# Altium schematic sheet k02-breakout.SchDoc
size Letter
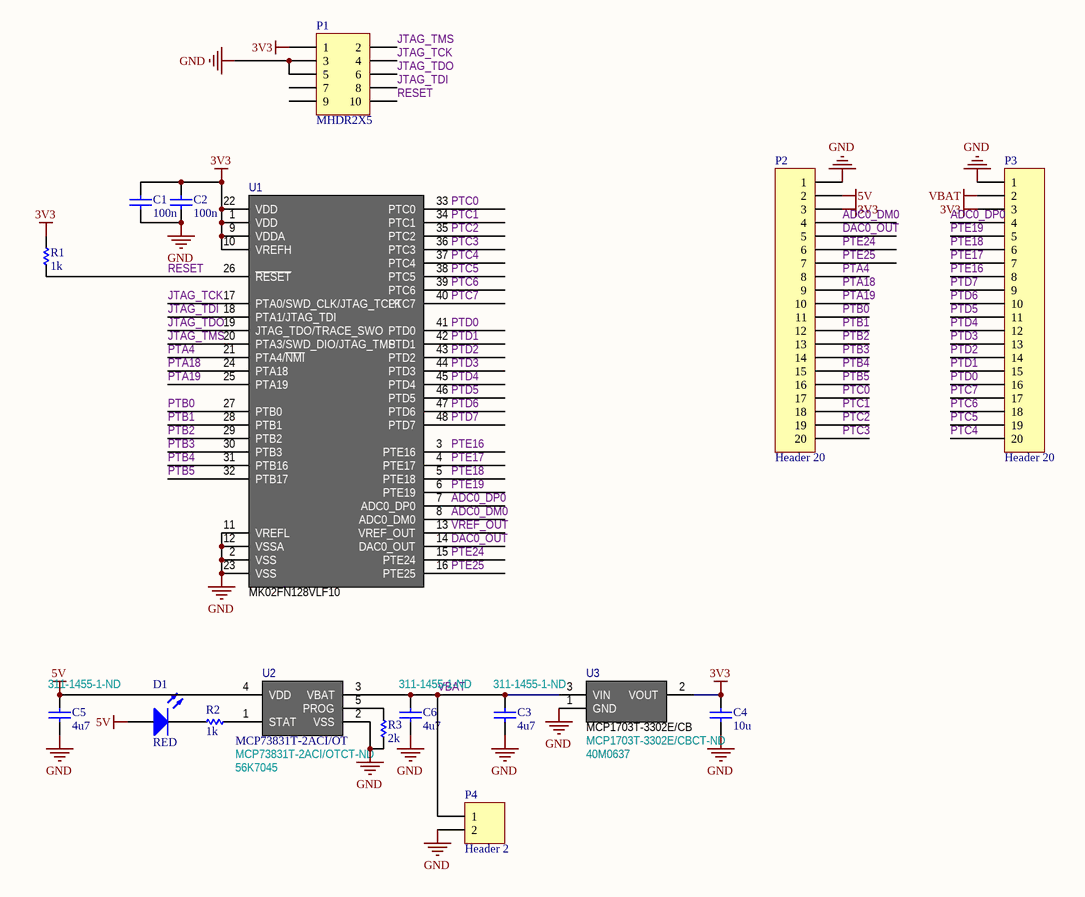
[diagram p0: k02-breakout.SchDoc]

## Parts
C1  100n  [CAPC1608N]
C2  100n  [CAPC1608N]
C3  4u7  Supplier Part Number 1: 311-1455-1-ND  [CAPC1608N]
C4  10u  [CAPC1608N]
C5  4u7  Supplier Part Number 1: 311-1455-1-ND  [CAPC1608N]
C6  4u7  Supplier Part Number 1: 311-1455-1-ND  [CAPC1608N]
D1  RED  [LTST-C190EKT]
P1  MHDR2X5  [MHDR2X5SMD]
P2  Header 20  [HDR1X20]
P3  Header 20  [HDR1X20]
P4  Header 2  [S2B-PH-SM4-TB]
R1  1k  [RESC1608N]
R2  1k  [RESC1608N]
R3  2k  [RESC1608N]
U1  MK02FN128VLF10  [TSQFP50P900X900-48N]
U2  MCP73831T-2ACI/OT  Supplier Part Number 1: MCP73831T-2ACI/OTCT-ND  Supplier Part Number 2: 56K7045  [SOT23-5AN]
U3  MCP1703T-3302E/CB  Supplier Part Number 1: MCP1703T-3302E/CBCT-ND  Supplier Part Number 2: 40M0637  [SOT23-3N]

## Nets
3V3: C1.2 C2.2 C4.2 P1.1 P2.3 P3.3 R1.2 U1.1(VDD) U1.9(VDDA) U1.10(VREFH) U1.22(VDD) U3.2(VOUT)
5V: C5.2 D1.1(A) P2.2 U2.4(VDD)
GND: C1.1 C2.1 C3.1 C4.1 C5.1 C6.1 P1.3 P1.5 P2.1 P3.1 P4.2 R3.1 U1.2(VSS) U1.11(VREFL) U1.12(VSSA) U1.23(VSS) U2.2(VSS) U3.1(GND)
VBAT: C3.2 C6.2 P3.2 P4.1 U2.3(VBAT) U3.3(VIN)
ADC0_DM0: P2.4 U1.8(ADC0_DM0)
ADC0_DP0: P3.4 U1.7(ADC0_DP0)
DAC0_OUT: P2.5 U1.14(DAC0_OUT)
JTAG_TCK: P1.4 U1.17(PTA0/SWD_CLK/JTAG_TCLK)
JTAG_TDI: P1.8 U1.18(PTA1/JTAG_TDI)
JTAG_TDO: P1.6 U1.19(JTAG_TDO/TRACE_SWO)
JTAG_TMS: P1.2 U1.20(PTA3/SWD_DIO/JTAG_TMS)
PTA4: P2.8 U1.21(PTA4/~{NMI})
PTA18: P2.9 U1.24(PTA18)
PTA19: P2.10 U1.25(PTA19)
PTB0: P2.11 U1.27(PTB0)
PTB1: P2.12 U1.28(PTB1)
PTB2: P2.13 U1.29(PTB2)
PTB3: P2.14 U1.30(PTB3)
PTB4: P2.15 U1.31(PTB16)
PTB5: P2.16 U1.32(PTB17)
PTC0: P2.17 U1.33(PTC0)
PTC1: P2.18 U1.34(PTC1)
PTC2: P2.19 U1.35(PTC2)
PTC3: P2.20 U1.36(PTC3)
PTC4: P3.20 U1.37(PTC4)
PTC5: P3.19 U1.38(PTC5)
PTC6: P3.18 U1.39(PTC6)
PTC7: P3.17 U1.40(PTC7)
PTD0: P3.16 U1.41(PTD0)
PTD1: P3.15 U1.42(PTD1)
PTD2: P3.14 U1.43(PTD2)
PTD3: P3.13 U1.44(PTD3)
PTD4: P3.12 U1.45(PTD4)
PTD5: P3.11 U1.46(PTD5)
PTD6: P3.10 U1.47(PTD6)
PTD7: P3.9 U1.48(PTD7)
PTE16: P3.8 U1.3(PTE16)
PTE17: P3.7 U1.4(PTE17)
PTE18: P3.6 U1.5(PTE18)
PTE19: P3.5 U1.6(PTE19)
PTE24: P2.6 U1.15(PTE24)
PTE25: P2.7 U1.16(PTE25)
RESET: P1.10 R1.1 U1.26(~{RESET})
VREF_OUT: U1.13(VREF_OUT)
NetD1_2: D1.2(K) R2.2
NetR2_1: R2.1 U2.1(STAT)
NetR3_2: R3.2 U2.5(PROG)

Not connected (* = marked no-connect by the designer): P1 7 9

## Library data of the parts
C1 C2 C4 = Cap Semi: Capacitor (Semiconductor SIM Model); Published: 8-Jun-2000; LatestRevisionDate: 29-May-2009; LatestRevisionNote: IPC-7351 Footprint Added.; PackageReference: C1206; Publisher: Altium Limited; PackageDescription: Chip Capacitor
C3 C5 C6 = Cap Semi: CAP SEMI 4U7 10V 0603; Published: 8-Jun-2000; LatestRevisionDate: 29-May-2009; LatestRevisionNote: IPC-7351 Footprint Added.; PackageReference: C1206; Publisher: Altium Limited; PackageDescription: Chip Capacitor; Supplier 1: Digi-Key
D1 = LED_GREEN: Typical greenGaAs LED; Published: 8-Jun-2000; LatestRevisionDate: 17-Jul-2002; LatestRevisionNote: Re-released for DXP Platform.; PackageVersion: Feb-2002; PackageReference: 3.2X1.6X1.1; Publisher: Altium Limited; PackageDescription: SM LED; 2 Flat Leads
P1 = MHDR2X5: Header, 5-Pin, Dual row; LatestRevisionDate: 17-Jul-2002; LatestRevisionNote: Re-released for DXP Platform.; Publisher: Altium Limited; Supplier 1: Digi-Key; Supplier Part Number 1: 609-4054-ND
P2 P3 = Header 20: Header, 20-Pin; LatestRevisionDate: 17-Jul-2002; LatestRevisionNote: Re-released for DXP Platform.; Publisher: Altium Limited
P4 = Header 2: Header, 2-Pin; LatestRevisionDate: 17-Jul-2002; LatestRevisionNote: Re-released for DXP Platform.; Publisher: Altium Limited
R1-R3 = Res Semi: Semiconductor Resistor; Published: 8-Jun-2000; LatestRevisionDate: 17-Jul-2002; LatestRevisionNote: Re-released for DXP Platform.; PackageReference: AXIAL-0.5; Publisher: Altium Limited; PackageDescription: Axial Device, Thru-Hole; 2 Leads; 0.5 in Pin Spacing
U1 = MK02FN128VLF10: IC MCU ARM 100MHz 128KB FLASH LQFP48
U2 = MCP73831T-2ACI/OT: IC CONTROLLR LI-ION 4.2V SOT23-5; Manufacturer: Microchip Technology; Function: Charge Management; Battery Chemistry: Li-Ion, Li-Pol; Voltage - Supply: 3.75 V ~ 6 V; Supplier 1: Digi-Key; Manufacturer Part Number: MCP73831T-2ACI/OT; RoHS: RoHS Compliant; Category: Integrated Circuits (ICs); Stock 1: 38003; Pricing 1: 1=0.67, 10=0.56, 25=0.47, 100=0.42 (USD); Packaging: Cut Tape (CT); Operating Temperature: -40°C ~ 85°C; Mounting Type: Surface Mount; Package / Case: SC-74A, SOT-753; Supplier Device Package: SOT-23-5; ComponentLink1URL: http://www.microchip.com/mymicrochip/filehandler.aspx?ddocname=en025112; ComponentLink1Description: http://www.microchip.com/mymicrochip/filehandler.aspx?ddocname=en025112; Supplier 2: Newark
U3 = MCP1703T-3302E/CB: IC REG LDO 3.3V 0.25A SOT23A-3; Manufacturer: Microchip Technology; Regulator Topology: Positive Fixed; Current - Output: 250mA; Voltage - Dropout (Typical): 0.525V @ 250mA; Number of Regulators: 1; Voltage - Input: Up to 16V; Supplier 1: Digi-Key; Manufacturer Part Number: MCP1703T-3302E/CB; RoHS: RoHS Compliant; Category: Integrated Circuits (ICs); Stock 1: 12286; Pricing 1: 1=0.54, 25=0.45, 100=0.41 (USD); Packaging: Cut Tape (CT); Voltage - Output: 3.3V; Current - Limit (Min): -; Operating Temperature: -40°C ~ 125°C; Mounting Type: Surface Mount; Package / Case: TO-236-3, SC-59, SOT-23-3; Supplier Device Package: SOT-23A-3; ComponentLink1URL: http://www.microchip.com/mymicrochip/filehandler.aspx?ddocname=en530937; ComponentLink1Description: http://www.microchip.com/mymicrochip/filehandler.aspx?ddocname=en530937; Supplier 2: Newark